# Altium project 200103 Brake Module R0.PrjPcb
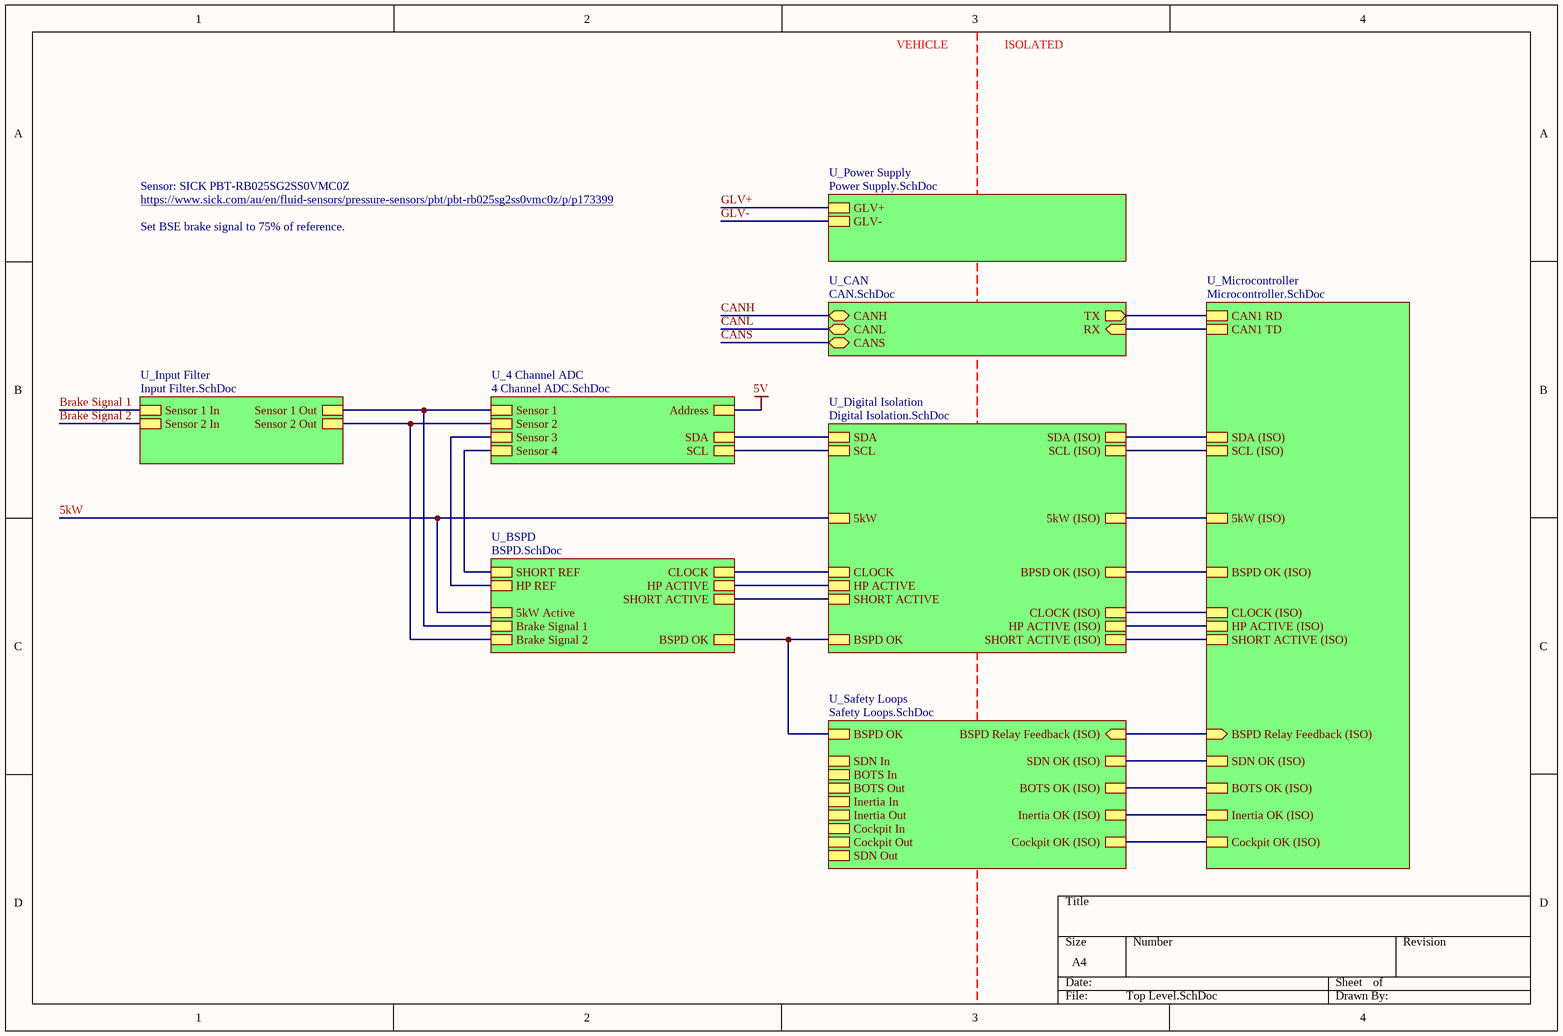
[diagram p0: Top Level.SchDoc]
7 sheets, 131 parts. Net scope: hierarchical (ports join the sheet entries above them; power ports are global).
Sheets:
  Top Level.SchDoc
    U_BSPD = BSPD.SchDoc
    U_Input Filter = Input Filter.SchDoc
    U_Digital Isolation = Digital Isolation.SchDoc
    U_Microcontroller = Microcontroller.SchDoc
    U_Power Supply = Power Supply.SchDoc
    U_CAN = CAN.SchDoc

## Sheet Top Level.SchDoc
size A4

### Sub-sheets
U_4 Channel ADC = 4 Channel ADC.SchDoc (file not in this document): Address, SCL, SDA, Sensor 1, Sensor 2, Sensor 3, Sensor 4
U_BSPD = BSPD.SchDoc: BSPD OK, HP ACTIVE, SHORT ACTIVE, CLOCK, HP REF, SHORT REF, 5kW Active, Brake Signal 1, Brake Signal 2
U_CAN = CAN.SchDoc: CANS (bidir), RX (in), CANL (bidir), CANH (bidir), TX (out)
U_Digital Isolation = Digital Isolation.SchDoc: SDA (ISO), SCL (ISO), SDA, SCL, CLOCK (ISO), HP ACTIVE (ISO), SHORT ACTIVE (ISO), BPSD OK (ISO), 5kW, 5kW (ISO), BSPD OK, HP ACTIVE, SHORT ACTIVE, CLOCK
U_Input Filter = Input Filter.SchDoc: Sensor 1 In, Sensor 1 Out, Sensor 2 In, Sensor 2 Out
U_Microcontroller = Microcontroller.SchDoc: BSPD OK (ISO), 5kW (ISO), CLOCK (ISO), HP ACTIVE (ISO), SHORT ACTIVE (ISO), SDA (ISO), SCL (ISO), CAN1 RD, CAN1 TD, Cockpit OK (ISO), SDN OK (ISO), BOTS OK (ISO), Inertia OK (ISO), BSPD Relay Feedback (ISO) (in)
U_Power Supply = Power Supply.SchDoc: GLV+, GLV-
U_Safety Loops = Safety Loops.SchDoc (file not in this document): Cockpit OK (ISO), SDN OK (ISO), BOTS OK (ISO), Inertia OK (ISO), BOTS In, Inertia In, Cockpit Out, Cockpit In, Inertia Out, BOTS Out, SDN Out, SDN In, BSPD Relay Feedback (ISO) (in), BSPD OK

### Nets
5kW: sheet U_BSPD/5kW Active, sheet U_Digital Isolation/5kW
Clock: sheet U_BSPD/CLOCK, sheet U_Digital Isolation/CLOCK
HP REF: sheet U_BSPD/HP REF, sheet U_4 Channel ADC/Sensor 3
PB6: sheet U_Digital Isolation/SCL (ISO), sheet U_Microcontroller/SCL (ISO)
PB7: sheet U_Digital Isolation/SDA (ISO), sheet U_Microcontroller/SDA (ISO)
PB8: sheet U_Microcontroller/CAN1 RD, sheet U_CAN/TX
PB9: sheet U_Microcontroller/CAN1 TD, sheet U_CAN/RX
PB11: sheet U_Digital Isolation/5kW (ISO), sheet U_Microcontroller/5kW (ISO)
PB12: sheet U_Digital Isolation/BPSD OK (ISO), sheet U_Microcontroller/BSPD OK (ISO)
PB13: sheet U_Digital Isolation/CLOCK (ISO), sheet U_Microcontroller/CLOCK (ISO)
PB14: sheet U_Digital Isolation/HP ACTIVE (ISO), sheet U_Microcontroller/HP ACTIVE (ISO)
PB15: sheet U_Digital Isolation/SHORT ACTIVE (ISO), sheet U_Microcontroller/SHORT ACTIVE (ISO)
SHORT REF: sheet U_BSPD/SHORT REF, sheet U_4 Channel ADC/Sensor 4
NetC33_2: sheet U_BSPD/BSPD OK, sheet U_Digital Isolation/BSPD OK, sheet U_Safety Loops/BSPD OK
NetC36_2: sheet U_BSPD/Brake Signal 1, sheet U_4 Channel ADC/Sensor 1, sheet U_Input Filter/Sensor 1 Out
NetC37_2: sheet U_BSPD/Brake Signal 2, sheet U_4 Channel ADC/Sensor 2, sheet U_Input Filter/Sensor 2 Out
NetR14_1: sheet U_4 Channel ADC/SDA, sheet U_Digital Isolation/SDA
NetR15_1: sheet U_4 Channel ADC/SCL, sheet U_Digital Isolation/SCL
NetU12_5: sheet U_BSPD/HP ACTIVE, sheet U_Digital Isolation/HP ACTIVE
NetU12_6: sheet U_BSPD/SHORT ACTIVE, sheet U_Digital Isolation/SHORT ACTIVE
(unnamed): sheet U_Microcontroller/Cockpit OK (ISO), sheet U_Safety Loops/Cockpit OK (ISO)
(unnamed): sheet U_Microcontroller/SDN OK (ISO), sheet U_Safety Loops/SDN OK (ISO)
(unnamed): sheet U_Microcontroller/BOTS OK (ISO), sheet U_Safety Loops/BOTS OK (ISO)
(unnamed): sheet U_Microcontroller/Inertia OK (ISO), sheet U_Safety Loops/Inertia OK (ISO)
(unnamed): sheet U_Microcontroller/BSPD Relay Feedback (ISO), sheet U_Safety Loops/BSPD Relay Feedback (ISO)

### Notes on the sheet
- VEHICLE
- ISOLATED
- Sensor: SICK PBT-RB025SG2SS0VMC0Z
- https://www.sick.com/au/en/fluid-sensors/pressure-sensors/pbt/pbt-rb025sg2ss0vmc0z/p/p173399
- Set BSE brake signal to 75% of reference.

## Sheet BSPD.SchDoc
size A4
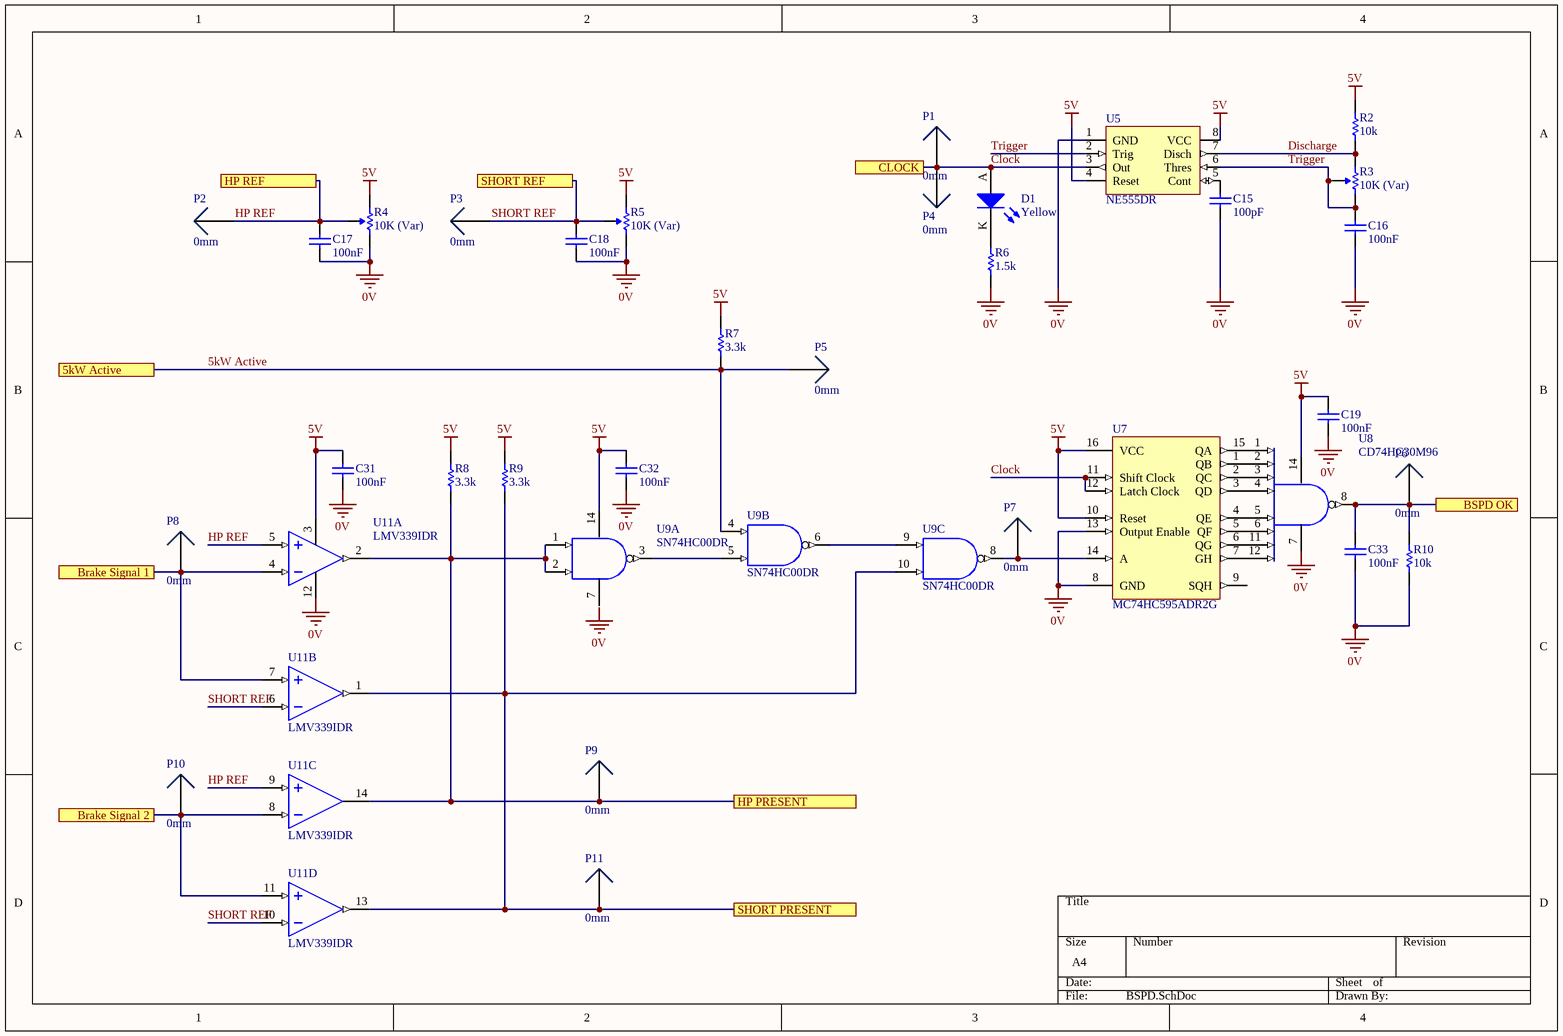
[diagram p1: BSPD.SchDoc]

### Parts
C15  100pF  [0805]
C16  100nF  [0805]
C17  100nF  [0805]
C18  100nF  [0805]
C19  100nF  [0805]
C31  100nF  [0805]
C32  100nF  [0805]
C33  100nF  [0805]
D1  Yellow  [0805 LED]
P1  0mm  [SMD Test Point]
P2  0mm  [TH Test Point]
P3  0mm  [TH Test Point]
P4  0mm  [TH Test Point]
P5  0mm  [SMD Test Point]
P6  0mm  [SMD Test Point]
P7  0mm  [SMD Test Point]
P8  0mm  [TH Test Point]
P9  0mm  [SMD Test Point]
P10  0mm  [TH Test Point]
P11  0mm  [SMD Test Point]
R2  10k  [0805]
R3  10K (Var)  [B 3296]
R4  10K (Var)  [B 3296]
R5  10K (Var)  [B 3296]
R6  1.5k  [0805]
R7  3.3k  [0805]
R8  3.3k  [0805]
R9  3.3k  [0805]
R10  10k  [0805]
U5  NE555DR  [TI 8-SOIC]
U7  MC74HC595ADR2G  [ON 16-SOIC]
U8  CD74HC30M96  [TI 14-SOIC]
U9  SN74HC00DR  [TI 14-SOIC]  (parts A,B,C of 4)
U11  LMV339IDR  [TI 14-SOIC]  (parts A,B,C,D of 4)

### Ports
5kW Active, Brake Signal 1, Brake Signal 2, BSPD OK, CLOCK, HP PRESENT, HP REF, SHORT PRESENT, SHORT REF

### Nets
0V: C15.1 C16.1 C17.1 C18.1 C19.1 C31.1 C32.1 C33.1 R4.1(CCW) R5.1(CCW) R6.1 R10.1 U5.1(GND) U7.8(GND) U7.13(Output_Enable) U8.7(GND) U11.12(V-)
5V: C19.2 C31.2 C32.2 R2.2 R4.3(CW) R5.3(CW) R7.2 R8.2 R9.2 U5.4(Reset) U5.8(VCC) U7.10(Reset) U7.16(VCC) U8.14(VCC) U9.14(VCC) U11.3(V+)
5kW Active: P5.1 R7.1 U9.4(2A) ; port 5kW Active  [project net 5kW]
Clock: D1.A P1.1 P4.1 U5.3(Out) U7.11(Shift_Clock) U7.12(Latch_Clock) ; port CLOCK
Discharge: R2.1 R3.3(CW) U5.7(Disch)
HP REF: C17.2 P2.1 R4.2(Wiper) U11.5(IN_A+) U11.9(IN_C+) ; port HP REF
SHORT REF: C18.2 P3.1 R5.2(Wiper) U11.6(IN_B-) U11.10(IN_D-) ; port SHORT REF
Trigger: C16.2 R3.1(CCW) R3.2(Wiper) U5.2(Trig) U5.6(Thres)
NetC15_2: C15.2 U5.5(Cont)
NetC33_2: C33.2 P6.1 R10.2 U8.8(Output) ; port BSPD OK
NetC36_2: P8.1 U11.4(IN_A-) U11.7(IN_B+) ; port Brake Signal 1
NetC37_2: P10.1 U11.8(IN_C-) U11.11(IN_D+) ; port Brake Signal 2
NetD1_K: D1.K R6.2
NetP7_1: P7.1 U7.14(A) U9.8(3Y)
NetP9_1: P9.1 R8.1 U9.1(1A) U9.2(1B) U11.2(OUT_A) U11.14(OUT_C) ; port HP PRESENT
NetP11_1: P11.1 R9.1 U9.10(3B) U11.1(OUT_B) U11.13(OUT_D) ; port SHORT PRESENT
NetU7_1: U7.1(QB) U8.2(Input)
NetU7_2: U7.2(QC) U8.3(Input)
NetU7_3: U7.3(QD) U8.4(Input)
NetU7_4: U7.4(QE) U8.5(Input)
NetU7_5: U7.5(QF) U8.6(Input)
NetU7_6: U7.6(QG) U8.11(Input)
NetU7_7: U7.7(GH) U8.12(Input)
NetU7_15: U7.15(QA) U8.1(Input)
NetU9_3: U9.3(1Y) U9.5(2B)
NetU9_6: U9.6(2Y) U9.9(3A)

Not connected (* = marked no-connect by the designer): U7 9(SQH); U9 7(GND)

### Notes on the sheet
- Labels drawn without touching a wire or pin: 0V

### Library data of the parts
C15 = GCM21B5C1H101JA37L: Manufacturer: muRata; Tolerance: 5%; Material: C0G; Rated Voltage: 50V; Part Number: GCM21B5C1H101JA37L; Value: 100pF
C16-C19 C31-C33 = GCM21BR71E104KA37L: Manufacturer: muRata; Tolerance: 10%; Material: X7R; Rated Voltage: 25V; Part Number: GCM21BR71E104KA37L; Value: 100nF
D1 = SML-211YTT86: Yellow LED Indication - Discrete 1.75V 0805 (2012 Metric); Manufacturer: ROHM Semiconductor; Part Number: SML-211YTT86; Colour: Yellow; Digikey Part Number: 511-1293-1-ND; Digikey Link: https://www.digikey.com/product-detail/en/rohm-semiconductor/SML-211YTT86/511-1293-1-ND/637106
P1 P5-P7 P9 P11 = SMD Test Point: Positions: 1; Row Spacing: 0; Flange: No; Contact: NA; Part Number: SMD Test Point; Pitch: 0mm; Angle: 0
P2-P4 P8 P10 = TH Test Point: Positions: 1; Angle: 0; Flange: No; Contact: NA; Part Number: TH Test Point; Pitch: 0mm; Row Spacing: 0mm
R2 R10 = RC0805FR0710KL: Manufacturer: YAGEO; Tolerance: 0.01; Rated Voltage: 0.125W; Part Number: RC0805FR0710KL; Value: 10k; Material: FR-07
R3-R5 = 3296W-1-103LF: Manufacturer: Bournes Inc; Tolerance: 0.1; Rated Voltage: 0.5W; Part Number: 3296W-1-103LF; Value: 10K (Var); Digikey Part Number: 3296W-103LF-ND
R6 = RC0805FR071K5L: Manufacturer: YAGEO; Tolerance: 0.01; Rated Voltage: 0.125W; Part Number: RC0805FR071K5L; Value: 1.5k; Material: FR-07
R7-R9 = RC0805FR073K3L: Manufacturer: YAGEO; Tolerance: 0.01; Rated Voltage: 0.125W; Part Number: RC0805FR073K3L; Value: 3.3k; Material: FR-07
U5 = NE555DR: IC OSC SGL TIMER 100KHZ 8-SOIC; Manufacturer: Texas Instruments; Part Number: NE555DR; Digikey Part Number: 296-6501-1-ND; Digikey Link: https://www.digikey.com.au/product-detail/en/texas-instruments/NE555DR/296-6501-1-ND/372490
U7 = MC74HC595ADR2G: IC SHIFT REGISTR 8BIT 3ST 16SOIC; Manufacturer: ON Semiconductor; Part Number: MC74HC595ADR2G; Digikey Part Number: MC74HC595ADR2GOSCT-ND; Digikey Link: https://www.digikey.com/product-detail/en/on-semiconductor/MC74HC595ADR2G/MC74HC595ADR2GOSCT-ND/1139727
U8 = CD74HC30M96: IC GATE NAND 1CH 8-INP 14SOIC; Manufacturer: Texas Instruments; Part Number: CD74HC30M96; Digikey Part Number: 296-14521-1-ND; Digikey Link: https://www.digikey.com/product-detail/en/texas-instruments/CD74HC30M96/296-14521-1-ND/555580
U9 = SN74HC00DR: NAND Gate IC 4 Channel 14-SOIC; Manufacturer: Texas Instruments; Part Number: SN74HC00DR; Digikey Part Number: 296-1187-2-ND; Digikey Link: https://www.digikey.com.au/product-detail/en/texas-instruments/SN74HC00DR/296-1187-2-ND/276830
U11 = LMV339IDR: Comparator General Purpose Open Collector 14-SOIC; Manufacturer: Texas Instruments; Part Number: LMV339IDR; Digikey Part Number: 296-6611-2-ND; Digikey Link: https://www.digikey.com/product-detail/en/texas-instruments/LMV339MTX-NOPB/296-35446-1-ND/3739150

## Sheet Input Filter.SchDoc
size A4
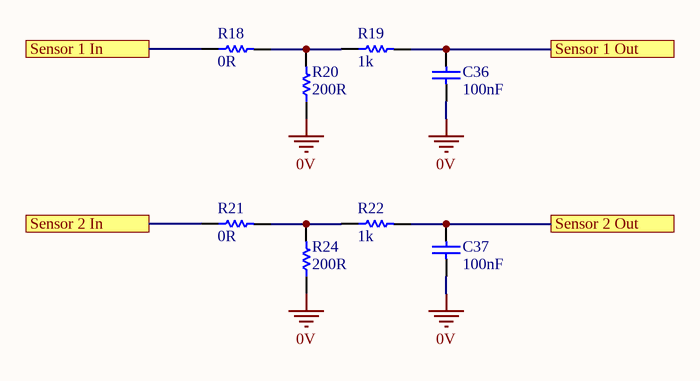
[diagram p2: Input Filter.SchDoc]

### Parts
C36  100nF  [0805]
C37  100nF  [0805]
R18  0R  [0805]
R19  1k  [0805]
R20  200R  [0805]
R21  0R  [0805]
R22  1k  [0805]
R24  200R  [0805]

### Ports
Sensor 1 In, Sensor 1 Out, Sensor 2 In, Sensor 2 Out

### Nets
0V: C36.1 C37.1 R20.1 R24.1
Brake Signal 1: R18.1 ; port Sensor 1 In
Brake Signal 2: R21.1 ; port Sensor 2 In
NetC36_2: C36.2 R19.2 ; port Sensor 1 Out
NetC37_2: C37.2 R22.2 ; port Sensor 2 Out
NetR18_2: R18.2 R19.1 R20.2
NetR21_2: R21.2 R22.1 R24.2

### Library data of the parts
C36 C37 = GCM21BR71E104KA37L: as C16 on sheet BSPD; Part Number: GCM21BR71E104KA37L; Value: 100nF
R18 R21 = RC0805FR070RL: Manufacturer: YAGEO; Tolerance: 0.01; Rated Voltage: 0.125W; Part Number: RC0805FR070RL; Value: 0R; Material: FR-07
R19 R22 = RC0805FR071KL: Manufacturer: YAGEO; Tolerance: 0.01; Rated Voltage: 0.125W; Part Number: RC0805FR071KL; Value: 1k; Material: FR-07
R20 R24 = RC0805FR07200RL: Manufacturer: YAGEO; Tolerance: 0.01; Rated Voltage: 0.125W; Part Number: RC0805FR07200RL; Value: 200R; Material: FR-07

## Sheet Digital Isolation.SchDoc
size A4
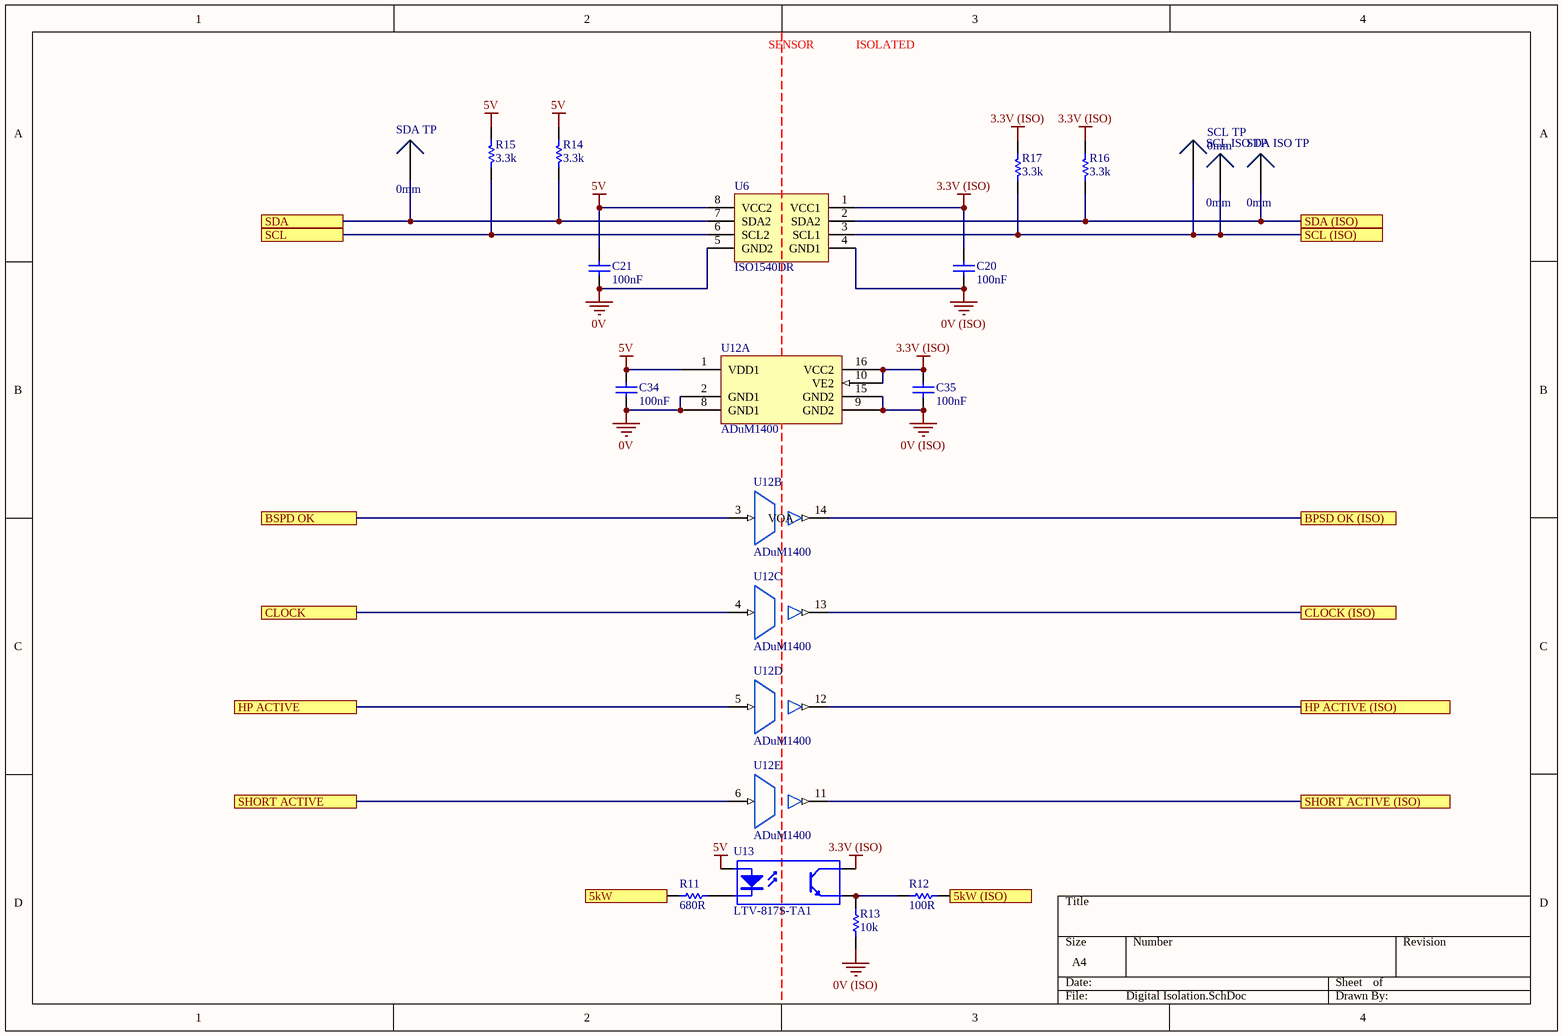
[diagram p3: Digital Isolation.SchDoc]

### Parts
C20  100nF  [0805]
C21  100nF  [0805]
C34  100nF  [0805]
C35  100nF  [0805]
R11  680R  [0805]
R12  100R  [0805]
R13  10k  [0805]
R14  3.3k  [0805]
R15  3.3k  [0805]
R16  3.3k  [0805]
R17  3.3k  [0805]
SCL_ISO_TP  0mm  [SMD Test Point]
SCL_TP  0mm  [SMD Test Point]
SDA_ISO_TP  0mm  [SMD Test Point]
SDA_TP  0mm  [SMD Test Point]
U6  ISO1540DR  [TI 8-SOIC]
U12  ADuM1400  [AD 16-SOIC]  (parts A,B,C,D,E of 5)
U13  LTV-817S-TA1  [ON 4-SMD]

### Ports
5kW, 5kW (ISO), BPSD OK (ISO), BSPD OK, CLOCK, CLOCK (ISO), HP ACTIVE, HP ACTIVE (ISO), SCL, SCL (ISO), SDA, SDA (ISO), SHORT ACTIVE, SHORT ACTIVE (ISO)

### Nets
0V: C21.1 C34.1 U6.5(GND2) U12.2(GND1) U12.8(GND1)
0V (ISO): C20.1 C35.1 R13.1 U6.4(GND1) U12.9(GND2) U12.15(GND2)
3.3V (ISO): C20.2 C35.2 R16.2 R17.2 U6.1(VCC1) U12.10(VE2) U12.16(VCC2) U13.4(C)
5V: C21.2 C34.2 R14.2 R15.2 U6.8(VCC2) U12.1(VDD1) U13.1(A)
5kW: R11.2 ; port 5kW
Clock: U12.4(VIB) ; port CLOCK
PB6: R17.1 SCL_ISO_TP.1 SCL_TP.1 U6.3(SCL1) ; port SCL (ISO)
PB7: R16.1 SDA_ISO_TP.1 U6.2(SDA2) ; port SDA (ISO)
PB11: R12.2 ; port 5kW (ISO)
PB12: U12.14(VOA) ; port BPSD OK (ISO)
PB13: U12.13(VOB) ; port CLOCK (ISO)
PB14: U12.12(VOC) ; port HP ACTIVE (ISO)
PB15: U12.11(VOD) ; port SHORT ACTIVE (ISO)
NetC33_2: U12.3(VIA) ; port BSPD OK
NetR11_1: R11.1 U13.2(K)
NetR12_1: R12.1 R13.2 U13.3(E)
NetR14_1: R14.1 SDA_TP.1 U6.7(SDA2) ; port SDA
NetR15_1: R15.1 U6.6(SCL2) ; port SCL
NetU12_5: U12.5(VIC) ; port HP ACTIVE
NetU12_6: U12.6(VID) ; port SHORT ACTIVE

### Notes on the sheet
- SENSOR
- ISOLATED

### Library data of the parts
C20 C21 C34 C35 = GCM21BR71E104KA37L: as C16 on sheet BSPD; Part Number: GCM21BR71E104KA37L; Value: 100nF
R11 = RC0805FR07680RL: Manufacturer: YAGEO; Tolerance: 0.01; Rated Voltage: 0.125W; Part Number: RC0805FR07680RL; Value: 680R; Material: FR-07
R12 = RC0805FR07100RL: Manufacturer: YAGEO; Tolerance: 0.01; Rated Voltage: 0.125W; Part Number: RC0805FR07100RL; Value: 100R; Material: FR-07
R13 = RC0805FR0710KL: as R2 on sheet BSPD; Part Number: RC0805FR0710KL; Value: 10k; Material: FR-07
R14-R17 = RC0805FR073K3L: as R7 on sheet BSPD; Part Number: RC0805FR073K3L; Value: 3.3k; Material: FR-07
SCL_ISO_TP SCL_TP SDA_ISO_TP SDA_TP = SMD Test Point: as P1 on sheet BSPD; Part Number: SMD Test Point; Pitch: 0mm; Angle: 0
U6 = ISO1540DR: I2C Digital Isolator (Multichannel); Manufacturer: Texas Instruments; Part Number: ISO1540DR; Digikey Part Number: 296-34871-1-ND; Digikey Link: https://www.digikey.com/product-detail/en/texas-instruments/ISO1540DR/296-34871-1-ND/3587214
U12 = ADuM1400: General Purpose Digital Isolator 2500Vrms 4 Channel 1Mbps 25kV/µs CMTI 16-SOIC (0.295", 7.50mm Width); Manufacturer: Analog Devices; Part Number: ADuM1400; Digikey Part Number: ADUM1400WSRWZ-ND; Digikey Link: https://www.digikey.com/product-detail/en/analog-devices-inc/ADUM1400WSRWZ/ADUM1400WSRWZ-ND/1873713
U13 = LTV-817S-TA1: 35V 50ma Optocoupler (VF=1.2V); Manufacturer: Lite-On Inc; Part Number: LTV-817S-TA1; Digikey Part Number: 160-1893-2-ND; Digikey Link: https://www.digikey.com/product-detail/en/lite-on-inc/LTV-817S-TA1/160-1893-2-ND/388451

## Sheet Microcontroller.SchDoc
size A3
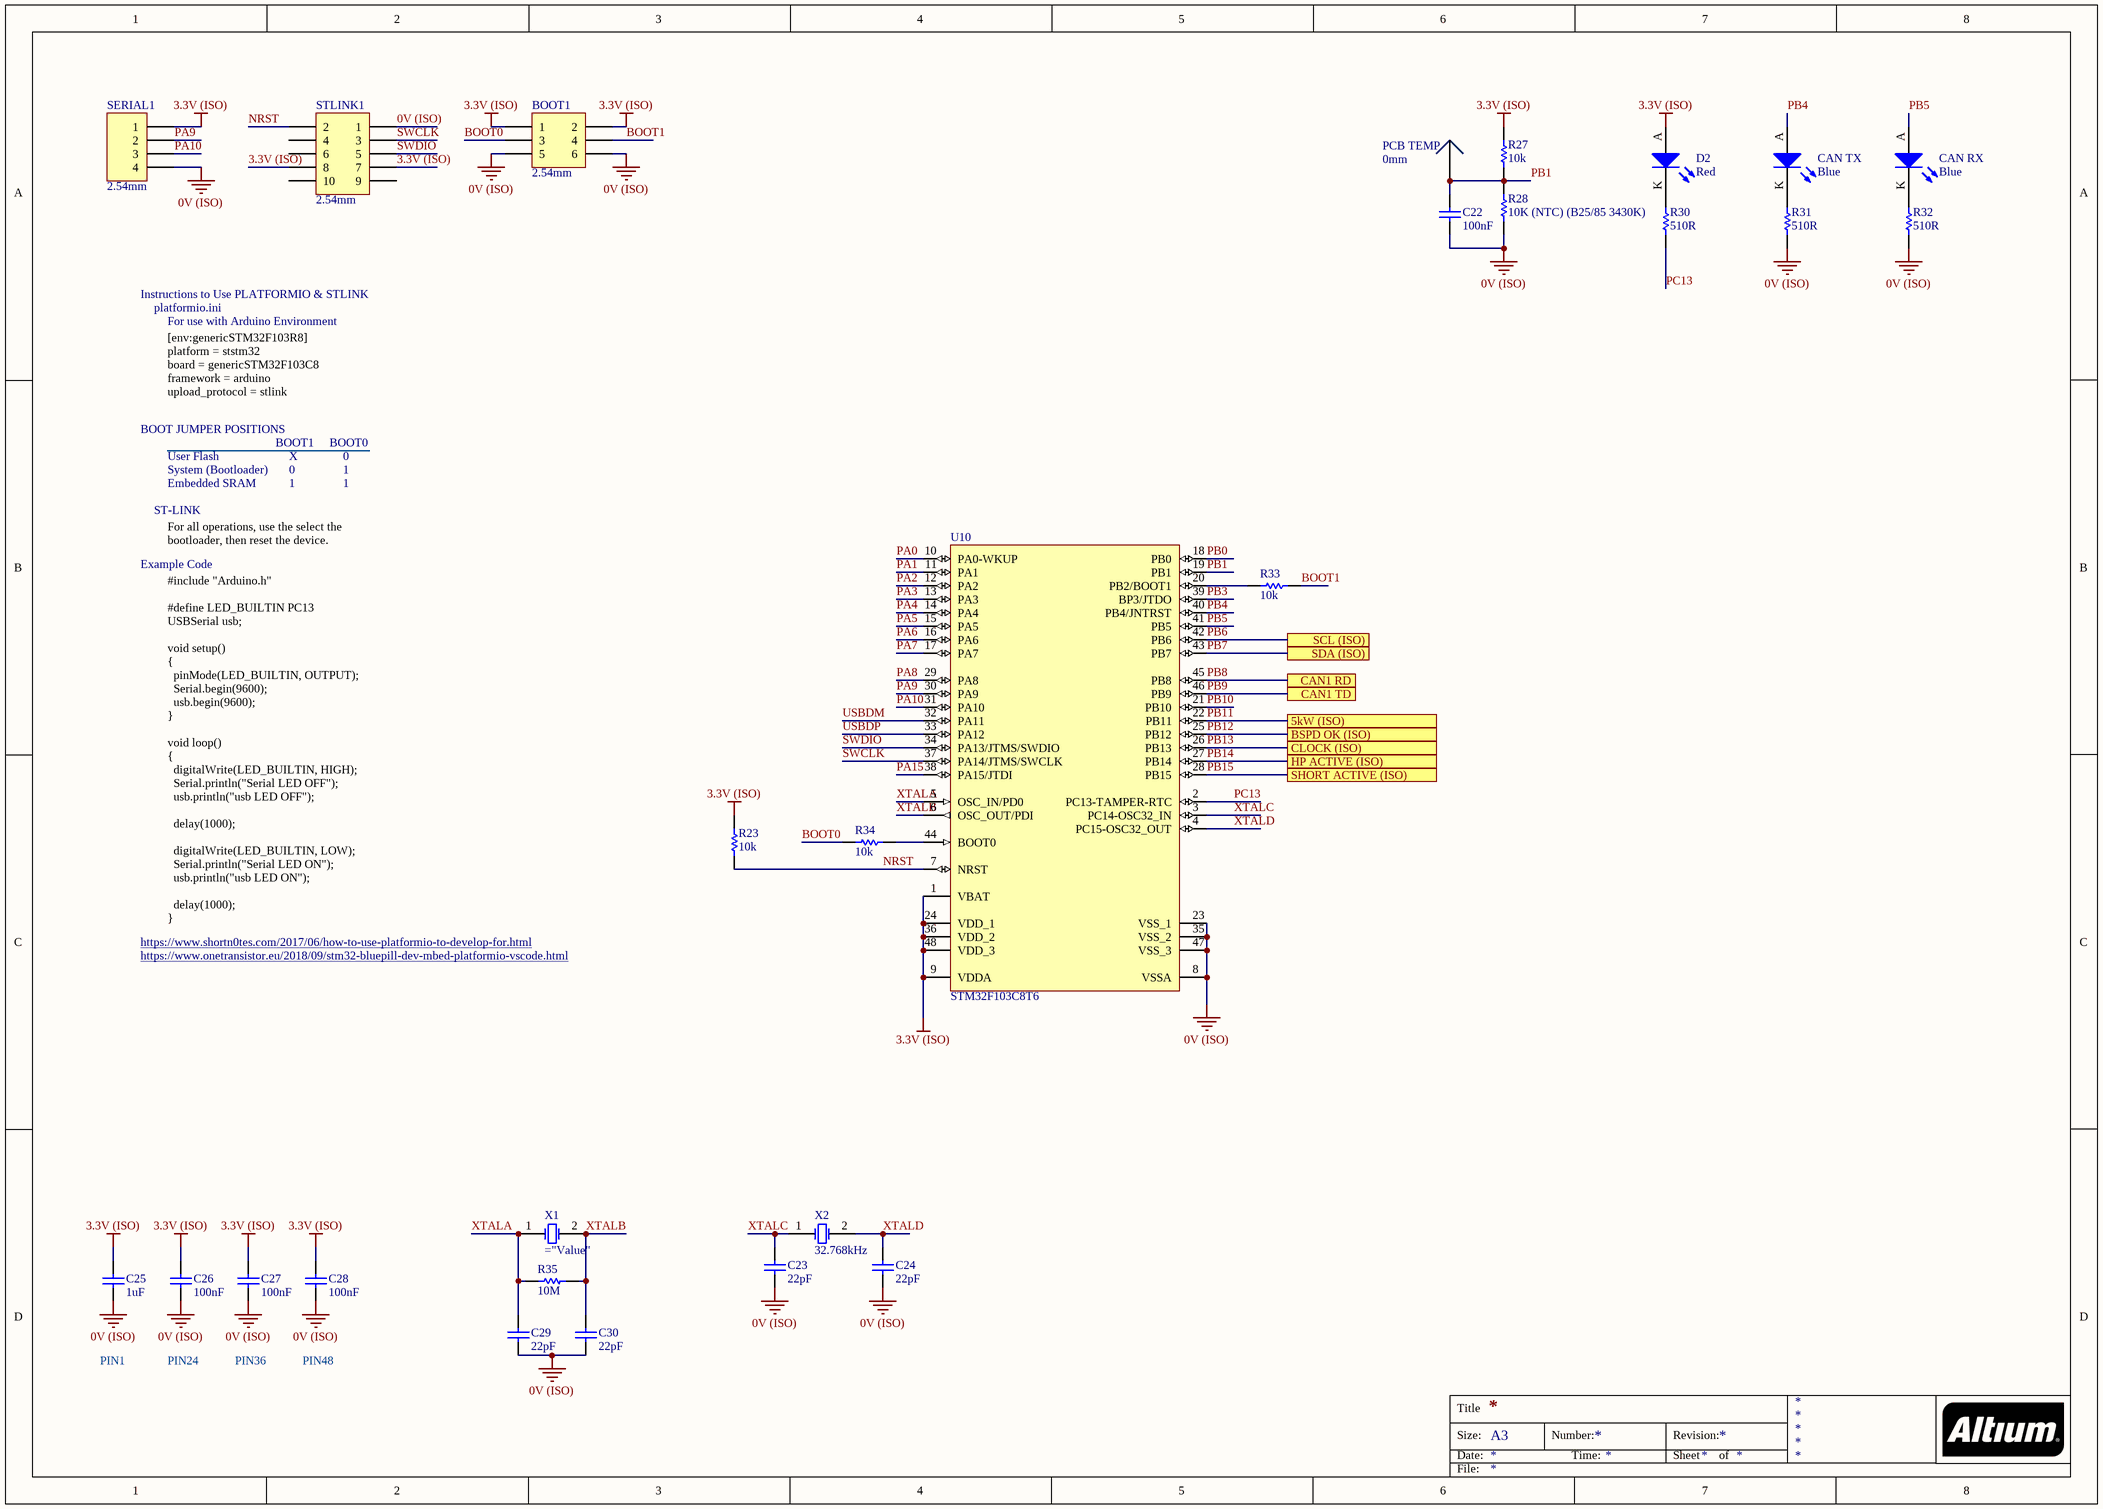
[diagram p4: Microcontroller.SchDoc]

### Parts
BOOT1  2.54mm  [TH 2.54mm Header 2x3]
C22  100nF  [0805]
C23  22pF  [0805]
C24  22pF  [0805]
C25  1uF  [0805]
C26  100nF  [0805]
C27  100nF  [0805]
C28  100nF  [0805]
C29  22pF  [0805]
C30  22pF  [0805]
CAN_RX  Blue  [0805 LED]
CAN_TX  Blue  [0805 LED]
D2  Red  [0805 LED]
PCB_TEMP  0mm  [SMD Test Point]
R23  10k  [0805]
R27  10k  [0805]
R28  10K (NTC) (B25/85 3430K)  [0805]
R30  510R  [0805]
R31  510R  [0805]
R32  510R  [0805]
R33  10k  [0805]
R34  10k  [0805]
R35  10M  [0805]
SERIAL1  2.54mm  [TH 2.54mm Header 1x4]
STLINK1  2.54mm  [TH 2.54mm Header 2x5]
U10  STM32F103C8T6  [STM 48-LQFP]
X1  (no value)  [Abracon HC-49/US]
X2  32.768kHz  [EPSON 2-SMD]

### Ports
5kW (ISO), BSPD OK (ISO), CAN1 RD, CAN1 TD, CLOCK (ISO), HP ACTIVE (ISO), SCL (ISO), SDA (ISO), SHORT ACTIVE (ISO)

### Nets
0V (ISO): BOOT1.5 BOOT1.6 C22.1 C23.1 C24.1 C25.1 C26.1 C27.1 C28.1 C29.1 C30.1 R28.1 R31.1 R32.1 SERIAL1.4 STLINK1.1 U10.8(VSSA) U10.23(VSS_1) U10.35(VSS_2) U10.47(VSS_3)
3.3V (ISO): BOOT1.1 BOOT1.2 C25.2 C26.2 C27.2 C28.2 D2.A R23.2 R27.2 SERIAL1.1 STLINK1.7 STLINK1.8 U10.1(VBAT) U10.9(VDDA) U10.24(VDD_1) U10.36(VDD_2) U10.48(VDD_3)
BOOT0: BOOT1.3 R34.1
BOOT1: BOOT1.4 R33.2
NRST: R23.1 STLINK1.2 U10.7(NRST)
PA0: U10.10(PA0-WKUP)
PA1: U10.11(PA1)
PA2: U10.12(PA2)
PA3: U10.13(PA3)
PA4: U10.14(PA4)
PA5: U10.15(PA5)
PA6: U10.16(PA6)
PA7: U10.17(PA7)
PA8: U10.29(PA8)
PA9: SERIAL1.2 U10.30(PA9)
PA10: SERIAL1.3 U10.31(PA10)
PA15: U10.38(PA15/JTDI)
PB0: U10.18(PB0)
PB1: C22.2 PCB_TEMP.1 R27.1 R28.2 U10.19(PB1)
PB3: U10.39(BP3/JTDO)
PB4: CAN_TX.A U10.40(PB4/JNTRST)
PB5: CAN_RX.A U10.41(PB5)
PB6: U10.42(PB6) ; port SCL (ISO)
PB7: U10.43(PB7) ; port SDA (ISO)
PB8: U10.45(PB8) ; port CAN1 RD
PB9: U10.46(PB9) ; port CAN1 TD
PB10: U10.21(PB10)
PB11: U10.22(PB11) ; port 5kW (ISO)
PB12: U10.25(PB12) ; port BSPD OK (ISO)
PB13: U10.26(PB13) ; port CLOCK (ISO)
PB14: U10.27(PB14) ; port HP ACTIVE (ISO)
PB15: U10.28(PB15) ; port SHORT ACTIVE (ISO)
PC13: R30.1 U10.2(PC13-TAMPER-RTC)
SWCLK: STLINK1.3 U10.37(PA14/JTMS/SWCLK)
SWDIO: STLINK1.5 U10.34(PA13/JTMS/SWDIO)
USBDM: U10.32(PA11)
USBDP: U10.33(PA12)
XTALA: C29.2 R35.1 U10.5(OSC_IN/PD0) X1.1(OSC1)
XTALB: C30.2 R35.2 U10.6(OSC_OUT/PDI) X1.2(OSC2)
XTALC: C23.2 U10.3(PC14-OSC32_IN) X2.1(OSC1)
XTALD: C24.2 U10.4(PC15-OSC32_OUT) X2.2(OSC2)
NetCAN_RX_K: CAN_RX.K R32.2
NetCAN_TX_K: CAN_TX.K R31.2
NetD2_K: D2.K R30.2
NetR33_1: R33.1 U10.20(PB2/BOOT1)
NetR34_2: R34.2 U10.44(BOOT0)

Not connected (* = marked no-connect by the designer): STLINK1 4 6 9 10

### Notes on the sheet
- Instructions to Use PLATFORMIO & STLINK
- platformio.ini
- For use with Arduino Environment
- BOOT JUMPER POSITIONS
- [env:genericSTM32F103R8]
  platform = ststm32
  board = genericSTM32F103C8
  framework = arduino
  upload_protocol = stlink
- BOOT1
- BOOT0
- ST-LINK
- User Flash
- System (Bootloader)
- Embedded SRAM
- X
- 1
- 0
- Example Code
- For all operations, use the select the bootloader, then reset the device.
- #include "Arduino.h"
  #define LED_BUILTIN PC13
  USBSerial usb;
  void setup()
  {
  pinMode(LED_BUILTIN, OUTPUT);
  Serial.begin(9600);
  usb.begin(9600);
  }
  void loop()
  {
  digitalWrite(LED_BUILTIN, HIGH);
  Serial.println("Serial LED OFF");
  usb.println("usb LED OFF");
  delay(1000);
  digitalWrite(LED_BUILTIN, LOW);
  Serial.println("Serial LED ON");
  usb.println("usb LED ON");
  delay(1000);
  }
- https://www.shortn0tes.com/2017/06/how-to-use-platformio-to-develop-for.html
- https://www.onetransistor.eu/2018/09/stm32-bluepill-dev-mbed-platformio-vscode.html
- PIN1
- PIN24
- PIN36
- PIN48
- Title
- Size:
- Date:
- A3
- Number:
- Time:
- Revision:
- Sheet
- of
- File:

### Library data of the parts
BOOT1 = TH 2.54mm Header 2x3: Positions: 6; Angle: 0; Flange: No; Contact: NA; Part Number: TH 2.54mm Header 2x3; Pitch: 2.54mm; Row Spacing: 2.54mm
C22 C26-C28 = GCM21BR71E104KA37L: as C16 on sheet BSPD; Part Number: GCM21BR71E104KA37L; Value: 100nF
C23 C24 C29 C30 = GCM21B5C1H220JA37L: Manufacturer: muRata; Tolerance: 5%; Material: C0G; Rated Voltage: 50V; Part Number: GCM21B5C1H220JA37L; Value: 22pF
C25 = GCM21BR71A105KA37L: Manufacturer: muRata; Tolerance: 10%; Material: X7R; Rated Voltage: 10V; Part Number: GCM21BR71A105KA37L; Value: 1uF
CAN_RX CAN_TX = SML-MN2BCTT86C: LED BLUE CLEAR 2012 SMD; Manufacturer: ROHM Semiconductor; Part Number: SML-MN2BCTT86C; Colour: Blue; Digikey Part Number: 846-1207-1-ND; Digikey Link: https://www.digikey.com/product-detail/en/rohm-semiconductor/SMLMN2BCTT86C/846-1207-1-ND/6057239
D2 = SML-210LTT86: Red LED Indication - Discrete 1.75V 0805 (2012 Metric); Manufacturer: ROHM Semiconductor; Part Number: SML-210LTT86; Colour: Red; Digikey Part Number: 511-1286-1-ND; Digikey Link: https://www.digikey.com/product-detail/en/rohm-semiconductor/SML-210LTT86/511-1286-1-ND/637099
PCB_TEMP = SMD Test Point: as P1 on sheet BSPD; Part Number: SMD Test Point; Pitch: 0mm; Angle: 0
R23 R27 R33 R34 = RC0805FR0710KL: as R2 on sheet BSPD; Part Number: RC0805FR0710KL; Value: 10k; Material: FR-07
R28 = NTCS0805E3103FLT: Manufacturer: Vishay Beyschlag; Tolerance: 0.01; Rated Voltage: 210mW; Part Number: NTCS0805E3103FLT; Value: 10K (NTC) (B25/85 3430K); Digikey Part Number: BC2733CT-ND
R30-R32 = RC0805FR07510RL: Manufacturer: YAGEO; Tolerance: 0.01; Rated Voltage: 0.125W; Part Number: RC0805FR07510RL; Value: 510R; Material: FR-07
R35 = RC0805FR0710ML: Manufacturer: YAGEO; Tolerance: 0.01; Rated Voltage: 0.125W; Part Number: RC0805FR0710ML; Value: 10M; Material: FR-07
SERIAL1 = TH 2.54mm Header 1x4: Positions: 4; Angle: 0; Flange: No; Contact: NA; Part Number: TH 2.54mm Header 1x4; Pitch: 2.54mm; Row Spacing: 2.54mm
STLINK1 = TH 2.54mm Header 2x5: Positions: 10; Angle: 0; Flange: No; Contact: NA; Part Number: TH 2.54mm Header 2x5; Pitch: 2.54mm; Row Spacing: 2.54mm
U10 = STM32F103C8T6: ARM® Cortex®-M3 STM32F1 Microcontroller IC 32-Bit 72MHz 64KB (64K x 8) FLASH; Manufacturer: STMicroelectronics; Part Number: STM32F103C8T6; Digikey Part Number: 497-6063-ND; Digikey Link: https://www.digikey.com/product-detail/en/stmicroelectronics/STM32F103C8T6/497-6063-ND/1646338
X1 = ABLS-16.000MHZ-B4-T: Manufacturer: Abracon LLC; Load Capacitance: 18pF; ESR: 40R; Part Number: ABLS-16.000MHZ-B4-T; Digikey Part Number: 535-10226-1-ND; Digikey Link: https://www.digikey.com/product-detail/en/abracon-llc/ABLS-16.000MHZ-B4-T/535-10226-1-ND/2184261
X2 = FC-135 32.7680KA-A5: Manufacturer: EPSON; Load Capacitance: 12.5pF; ESR: 70k; Part Number: FC-135 32.7680KA-A5; Value: 32.768kHz; Digikey Part Number: SER4103TR-ND; Digikey Link: https://www.digikey.com/product-detail/en/epson/FC-135-32.7680KA-A5/SER4103TR-ND/5259895

## Sheet Power Supply.SchDoc
size A4
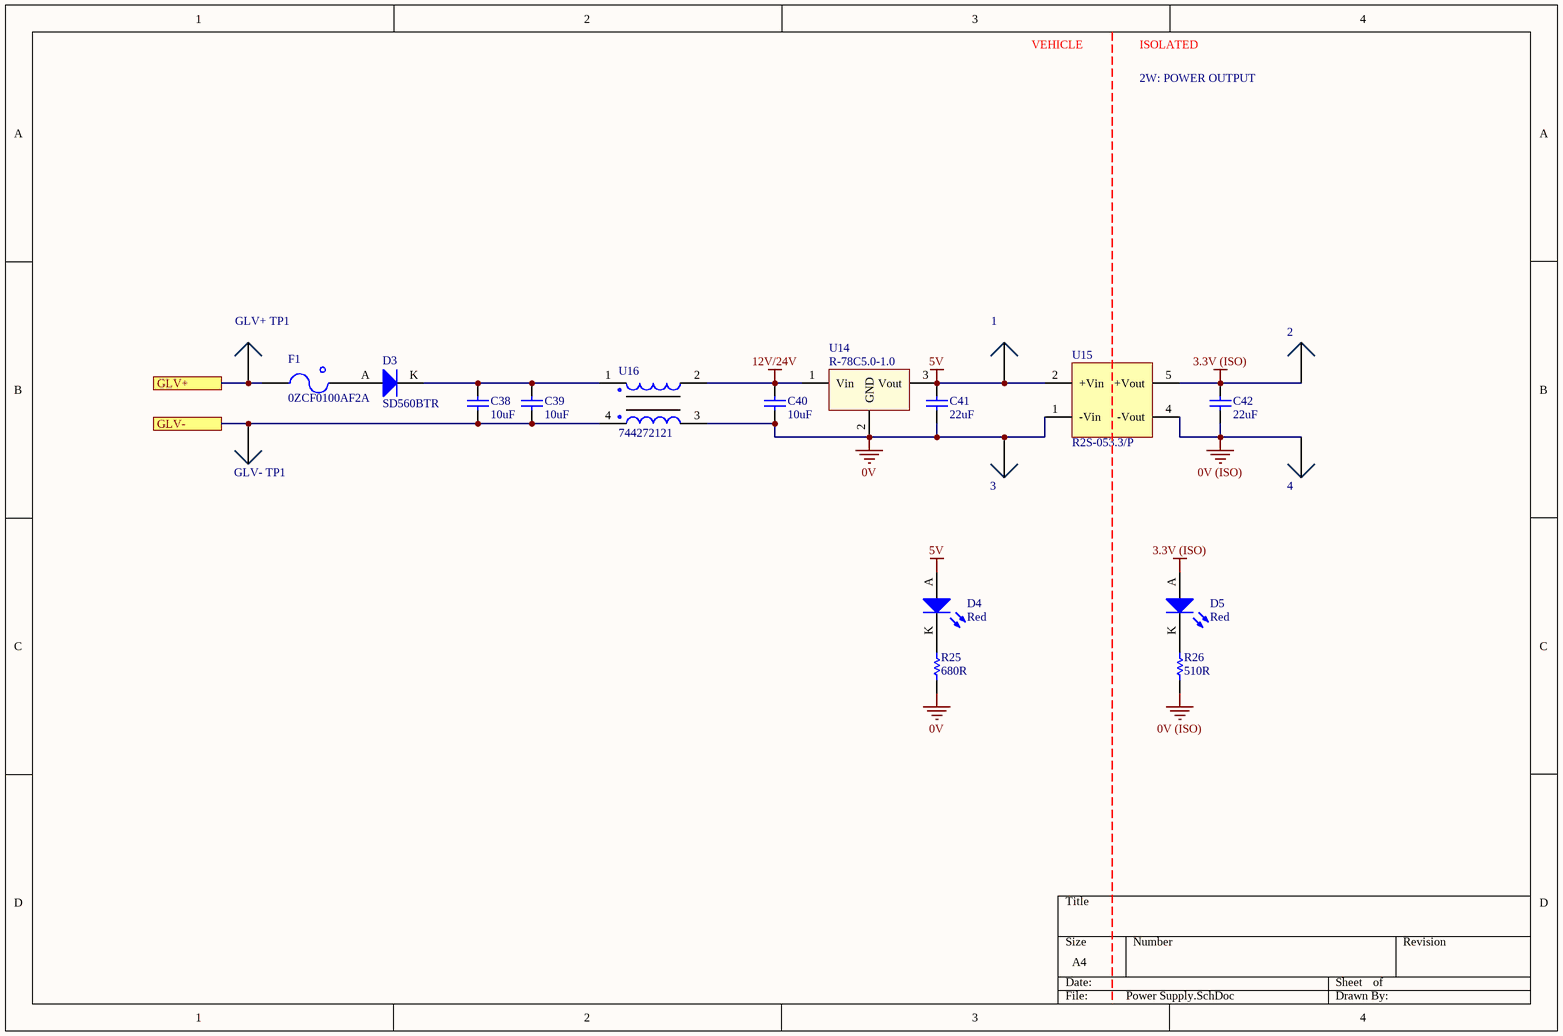
[diagram p5: Power Supply.SchDoc]

### Parts
1  0mm  [SMD Test Point]  (value not drawn)
2  0mm  [SMD Test Point]  (value not drawn)
3  0mm  [SMD Test Point]  (value not drawn)
4  0mm  [SMD Test Point]  (value not drawn)
C38  10uF  [0805]
C39  10uF  [0805]
C40  10uF  [0805]
C41  22uF  [1206]
C42  22uF  [1206]
D3  SD560BTR  [SMB Diode]
D4  Red  [0805 LED]
D5  Red  [0805 LED]
F1  0ZCF0100AF2A  [2920]
GLV+_TP1  0mm  [SMD Test Point]  (value not drawn)
GLV-_TP1  0mm  [SMD Test Point]  (value not drawn)
R25  680R  [0805]
R26  510R  [0805]
U14  R-78C5.0-1.0  [RECOM 3-SIP]
U15  R2S-053.3/P  [RECOM 8-SMD (5 Pin)]
U16  744272121  [Wurth 4-PC Pad]

### Ports
GLV+, GLV-

### Nets
0V: 3.1 C40.1 C41.1 R25.1 U14.2(GND) U15.1(-Vin) U16.3
0V (ISO): 4.1 C42.1 R26.1 U15.4(-Vout)
3.3V (ISO): 2.1 C42.2 D5.A U15.5(+Vout)
5V: 1.1 C41.2 D4.A U14.3(Vout) U15.2(+Vin)
12V/24V: C40.2 U14.1(Vin) U16.2
GLV+: F1.1 GLV+_TP1.1 ; port GLV+
GLV-: C38.1 C39.1 GLV-_TP1.1 U16.4 ; port GLV-
NetC38_2: C38.2 C39.2 D3.K U16.1
NetD3_A: D3.A F1.2
NetD4_K: D4.K R25.2
NetD5_K: D5.K R26.2

### Notes on the sheet
- VEHICLE
- ISOLATED
- 2W: POWER OUTPUT

### Library data of the parts
1-4 GLV+_TP1 GLV-_TP1 = SMD Test Point: as P1 on sheet BSPD; Part Number: SMD Test Point; Pitch: 0mm; Angle: 0
C38-C40 = GRM21BR6YA106KE43L: Manufacturer: muRata; Tolerance: 10%; Material: X5R; Rated Voltage: 50V; Part Number: GRM21BR6YA106KE43L; Value: 10uF; Digikey Part Number: 490-10514-6-ND
C41 C42 = CC1206MKX5R7BB226: Manufacturer: YAGEO; Tolerance: 20%; Material: Ceramic; Rated Voltage: 16V; Part Number: CC1206MKX5R7BB226; Value: 22uF; Digikey Part Number: 311-1997-2-ND
D3 = SD560BTR: 1.2V_F 600V 5A SMB; Manufacturer: SMC Diode Solutions; Part Number: SD560BTR; Digikey Part Number: 1655-1530-2-ND; Digikey Link: https://www.digikey.com/product-detail/en/smc-diode-solutions/SD560BTR/1655-1530-2-ND/6022620
D4 D5 = SML-210LTT86: as D2 on sheet Microcontroller; Part Number: SML-210LTT86; Colour: Red; Digikey Part Number: 511-1286-1-ND; Digikey Link: https://www.digikey.com/product-detail/en/rohm-semiconductor/SML-210LTT86/511-1286-1-ND/637099
F1 = 0ZCF0100AF2A: PTC RESET FUSE 60V 1A 292; Manufacturer: Littelfuse Inc.; Part Number: 0ZCF0100AF2A; Digikey Part Number: 507-2070-1-ND; Digikey Link: https://www.digikey.com/product-detail/en/bel-fuse-inc/0ZCF0100AF2A/507-2070-1-ND/6210547
R25 = RC0805FR07680RL: as R11 on sheet Digital Isolation; Part Number: RC0805FR07680RL; Value: 680R; Material: FR-07
R26 = RC0805FR07510RL: as R30 on sheet Microcontroller; Part Number: RC0805FR07510RL; Value: 510R; Material: FR-07
U14 = R-78C5.0-1.0: CONV DC/DC 1A 5V OUT SIP VERT; Manufacturer: Recom; Isolation: Non-Isolated; Part Number: R-78C5.0-1.0; Digikey Part Number: 945-1395-5-ND; Digikey Link: https://www.digikey.com.au/product-detail/en/recom-power/R-78C5.0-1.0/945-1395-5-ND/2652148
U15 = R2S-053.3/P: Isolated Module DC DC Converter 1 Output 3.3V 606mA 4.5V - 5.5V Input; Manufacturer: Recom; Output Power: 2W; Efficiency: 0.75; Part Number: R2S-053.3/P; Input Voltage: 4.5V-5.5V; Output Voltage: 3.3V; Isolation: Isolated; Digikey Part Number: 945-2677-5-ND; Digikey Link: https://www.digikey.com/product-detail/en/recom-power/R2S-053.3-P/945-2677-5-ND/2302804
U16 = 744272121: 120µH @ 100kHz 2 Line Common Mode Choke Surface Mount 460 Ohms @ 30MHz 2.5A DCR 25mOhm; Manufacturer: Wurth Electronics Inc; Inductance: 120uH @ 100kHz; Part Number: 744272121; Impedence: 460 Ohms @ 30MHz; Material: Wirewound; Rated Current: 2.5A; Digikey Part Number: 732-1489-1-ND; Digikey Link: https://www.digikey.com/product-detail/en/w-rth-elektronik/744272121/732-1489-1-ND/1639501

## Sheet CAN.SchDoc
size A4
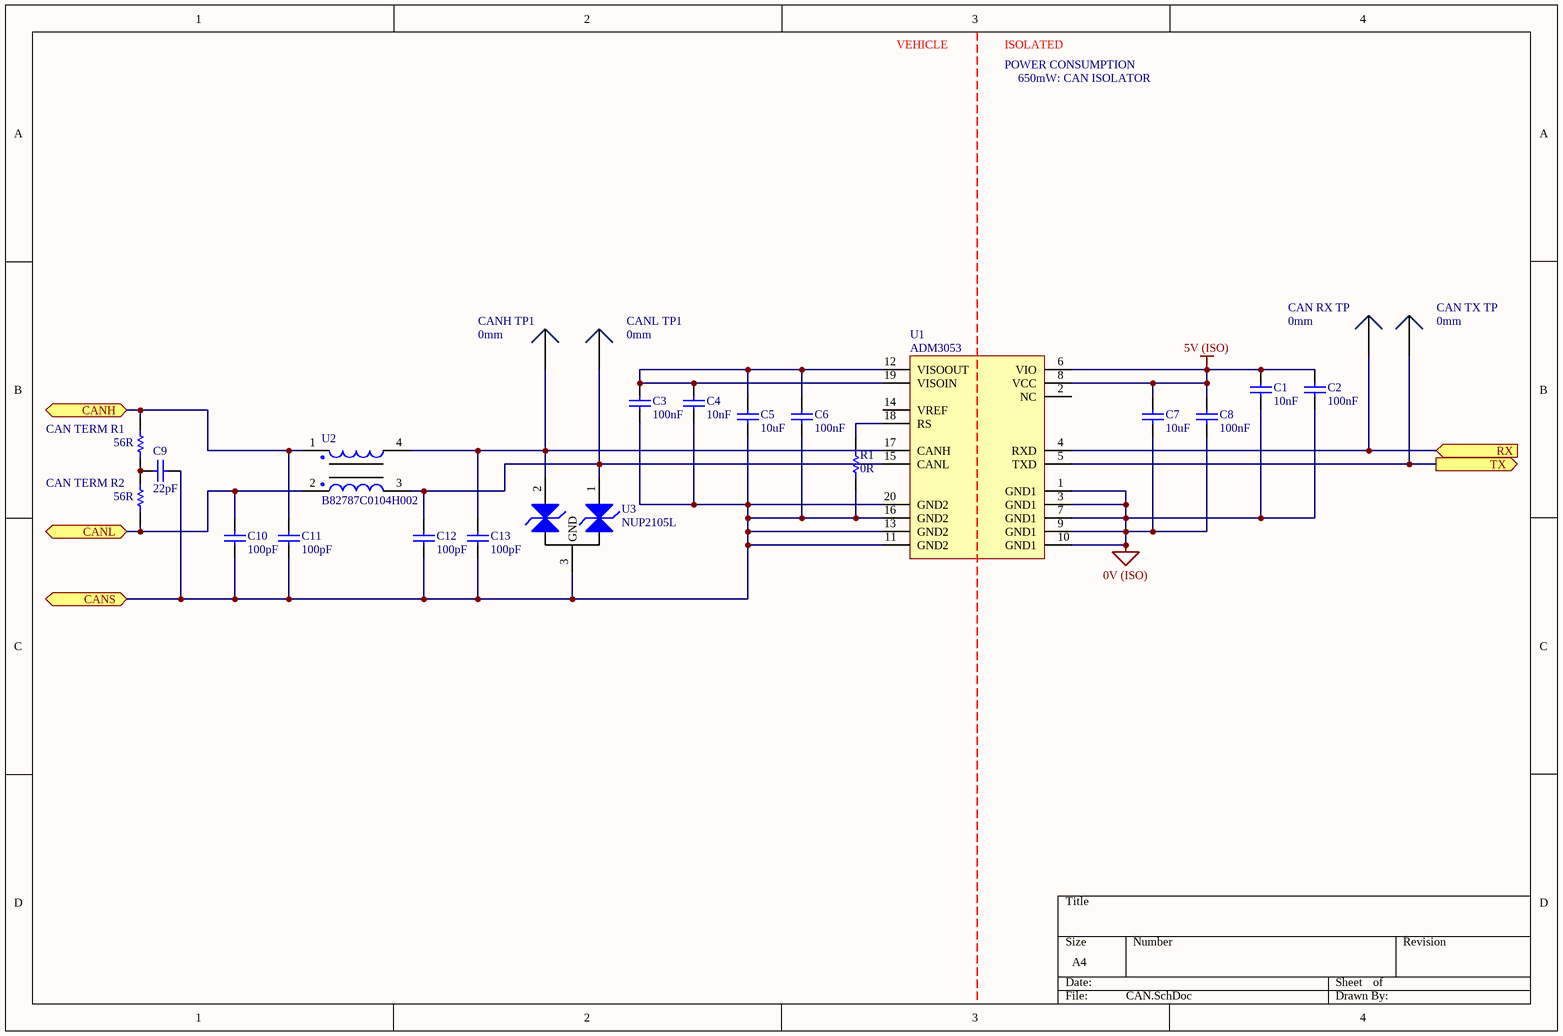
[diagram p6: CAN.SchDoc]

### Parts
C1  10nF  [1206]
C2  100nF  [0805]
C3  100nF  [0805]
C4  10nF  [1206]
C5  10uF  [0805]
C6  100nF  [0805]
C7  10uF  [0805]
C8  100nF  [0805]
C9  22pF  [0805]
C10  100pF  [0805]
C11  100pF  [0805]
C12  100pF  [0805]
C13  100pF  [0805]
CAN_RX_TP  0mm  [SMD Test Point]
CAN_TERM_R1  56R  [0805]
CAN_TERM_R2  56R  [0805]
CAN_TX_TP  0mm  [SMD Test Point]
CANH_TP1  0mm  [SMD Test Point]
CANL_TP1  0mm  [SMD Test Point]
R1  0R  [0805]
U1  ADM3053  [AD SOIC-W 20]
U2  B82787C0104H002  [TDK 4-PC Pad]
U3  NUP2105L  [ON SOT-23]

### Ports
CANH (bidir), CANL (bidir), CANS (bidir), RX (in), TX (out)

### Nets
0V (ISO): C1.1 C2.1 C7.1 C8.1 U1.1(GND1) U1.3(GND1) U1.7(GND1) U1.9(GND1) U1.10(GND1)
5V (ISO): C1.2 C2.2 C7.2 C8.2 U1.6(VIO) U1.8(VCC)
CANH: C11.2 CAN_TERM_R1.2 U2.1 ; port CANH
CANL: C10.2 CAN_TERM_R2.1 U2.2 ; port CANL
CANS: C3.1 C4.1 C5.1 C6.1 C9.1 C10.1 C11.1 C12.1 C13.1 R1.1 U1.11(GND2) U1.13(GND2) U1.16(GND2) U1.20(GND2) U3.3(GND) ; port CANS
PB8: CAN_TX_TP.1 U1.5(TXD) ; port TX
PB9: CAN_RX_TP.1 U1.4(RXD) ; port RX
NetC3_2: C3.2 C4.2 C5.2 C6.2 U1.12(VISOOUT) U1.19(VISOIN)
NetC9_2: C9.2 CAN_TERM_R1.1 CAN_TERM_R2.2
NetC12_2: C12.2 CANL_TP1.1 U1.15(CANL) U2.3 U3.1(CAN_H)
NetC13_2: C13.2 CANH_TP1.1 U1.17(CANH) U2.4 U3.2(CAN_L)
NetR1_2: R1.2 U1.18(RS)

Not connected (* = marked no-connect by the designer): U1 2(NC) 14(VREF)

### Notes on the sheet
- VEHICLE
- ISOLATED
- POWER CONSUMPTION
- 650mW: CAN ISOLATOR

### Library data of the parts
C1 C4 = GCM3195C2A103JA16D: Manufacturer: muRata; Tolerance: 5%; Material: Ceramic; Rated Voltage: 100V; Part Number: GCM3195C2A103JA16D; Value: 10nF; Digikey Part Number: 490-4978-2-ND
C2 C3 C6 C8 = GCM21BR71E104KA37L: as C16 on sheet BSPD; Part Number: GCM21BR71E104KA37L; Value: 100nF
C5 C7 = GRM21BR6YA106KE43L: as C38 on sheet Power Supply; Part Number: GRM21BR6YA106KE43L; Value: 10uF; Digikey Part Number: 490-10514-6-ND
C9 = GCM21B5C1H220JA37L: as C23 on sheet Microcontroller; Part Number: GCM21B5C1H220JA37L; Value: 22pF
C10-C13 = GCM21B5C1H101JA37L: as C15 on sheet BSPD; Part Number: GCM21B5C1H101JA37L; Value: 100pF
CAN_RX_TP CAN_TX_TP CANH_TP1 CANL_TP1 = SMD Test Point: as P1 on sheet BSPD; Part Number: SMD Test Point; Pitch: 0mm; Angle: 0
CAN_TERM_R1 CAN_TERM_R2 = RC0805FR0756RL: Manufacturer: YAGEO; Tolerance: 0.01; Rated Voltage: 0.125W; Part Number: RC0805FR0756RL; Value: 56R; Material: FR-07
R1 = RC0805FR070RL: as R18 on sheet Input Filter; Part Number: RC0805FR070RL; Value: 0R; Material: FR-07
U1 = ADM3053: Isolated CAN Transceiver; Manufacturer: Analogue Devices; Part Number: ADM3053; Digikey Part Number: ADM3053BRWZ-ND; Digikey Link: https://www.digikey.com/product-detail/en/analog-devices-inc/ADM3053BRWZ/ADM3053BRWZ-ND/2709332
U2 = B82787C0104H002: 100µH @ 100kHz 2 Line Common Mode Choke Surface Mount 5.8 kOhms @ 10MHz 150mA DCR 2Ohm; Manufacturer: EPCOS (TDK); Part Number: B82787C0104H002; Inductance: 100µH @ 100kHz; Impedence: 5.8 kOhms @ 10MHz; Material: Wirewound; Rated Current: 150mA; Digikey Part Number: 495-4598-1-ND; Digikey Link: https://www.digikey.com/product-detail/en/epcos-tdk/B82787C0104H002/495-4598-2-ND/3680998
U3 = NUP2105L: Dual Line CAN Bus Protector; Manufacturer: ON Semiconductor; Part Number: NUP2105L; Digikey Part Number: NUP2105LT1GOSCT-ND; Digikey Link: https://www.digikey.com/product-detail/en/on-semiconductor/NUP2105LT1G/NUP2105LT1GOSCT-ND/1485001

## Nets that join several sheets
0V: BSPD (17 pins), Input Filter (C36.1 C37.1 R20.1 R24.1), Digital Isolation (5 pins), Power Supply (7 pins)
0V (ISO): Digital Isolation (6 pins), Microcontroller (20 pins), Power Supply (4.1 C42.1 R26.1 U15.4), CAN (9 pins)
3.3V (ISO): Digital Isolation (8 pins), Microcontroller (17 pins), Power Supply (2.1 C42.2 D5.A U15.5)
5V: BSPD (16 pins), Digital Isolation (7 pins), Power Supply (5 pins)
5kW: BSPD (P5.1 R7.1 U9.4), Digital Isolation (R11.2)
Clock: BSPD (6 pins), Digital Isolation (U12.4)
NetC33_2: BSPD (C33.2 P6.1 R10.2 U8.8), Digital Isolation (U12.3)
NetC36_2: BSPD (P8.1 U11.4 U11.7), Input Filter (C36.2 R19.2)
NetC37_2: BSPD (P10.1 U11.8 U11.11), Input Filter (C37.2 R22.2)
PB6: Digital Isolation (R17.1 SCL_ISO_TP.1 SCL_TP.1 U6.3), Microcontroller (U10.42)
PB7: Digital Isolation (R16.1 SDA_ISO_TP.1 U6.2), Microcontroller (U10.43)
PB8: Microcontroller (U10.45), CAN (CAN_TX_TP.1 U1.5)
PB9: Microcontroller (U10.46), CAN (CAN_RX_TP.1 U1.4)
PB11: Digital Isolation (R12.2), Microcontroller (U10.22)
PB12: Digital Isolation (U12.14), Microcontroller (U10.25)
PB13: Digital Isolation (U12.13), Microcontroller (U10.26)
PB14: Digital Isolation (U12.12), Microcontroller (U10.27)
PB15: Digital Isolation (U12.11), Microcontroller (U10.28)